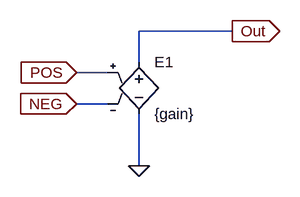
[diagram p0: schematic Draft5.asc]
Draft5.asc, the LTspice schematic file:
Version 4.1
SHEET 1 880 680
WIRE 384 48 240 48
WIRE 240 96 240 48
WIRE 192 112 144 112
WIRE 192 160 144 160
WIRE 240 256 240 176
FLAG 144 112 POS
IOPIN 144 112 In
FLAG 144 160 NEG
IOPIN 144 160 In
FLAG 240 256 0
FLAG 384 48 Out
IOPIN 384 48 Out
SYMBOL e 240 80 R0
SYMATTR InstName E1
SYMATTR Value {gain}

The netlist it stands for:
* Draft5.asc
E1 Out 0 POS NEG {gain}
.backanno
.end